# EAGLE design stm32hw06 (EAGLE 9.6.2)
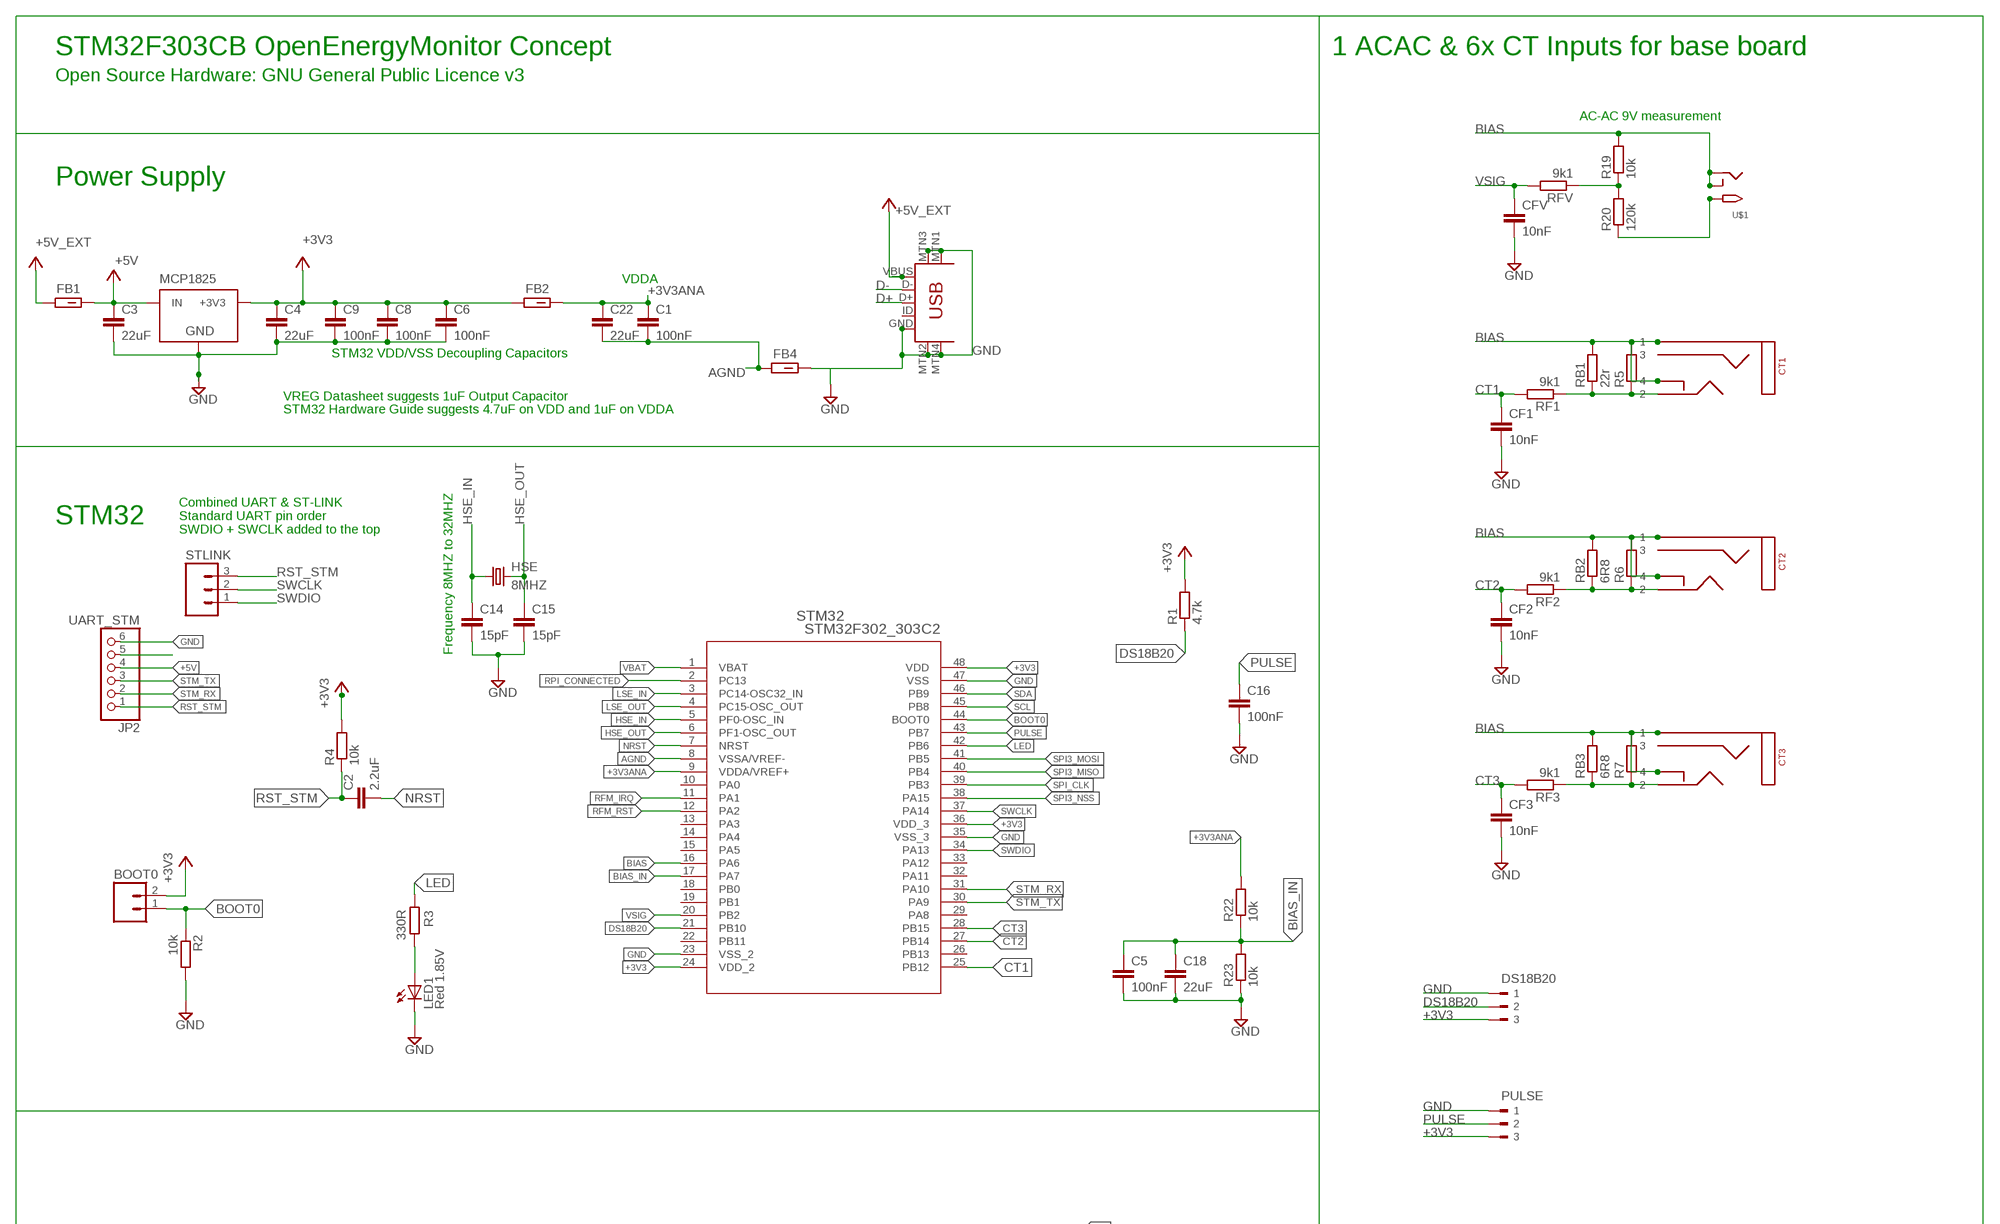
[diagram p0: schematic, sheet 1, part 1 of 2]
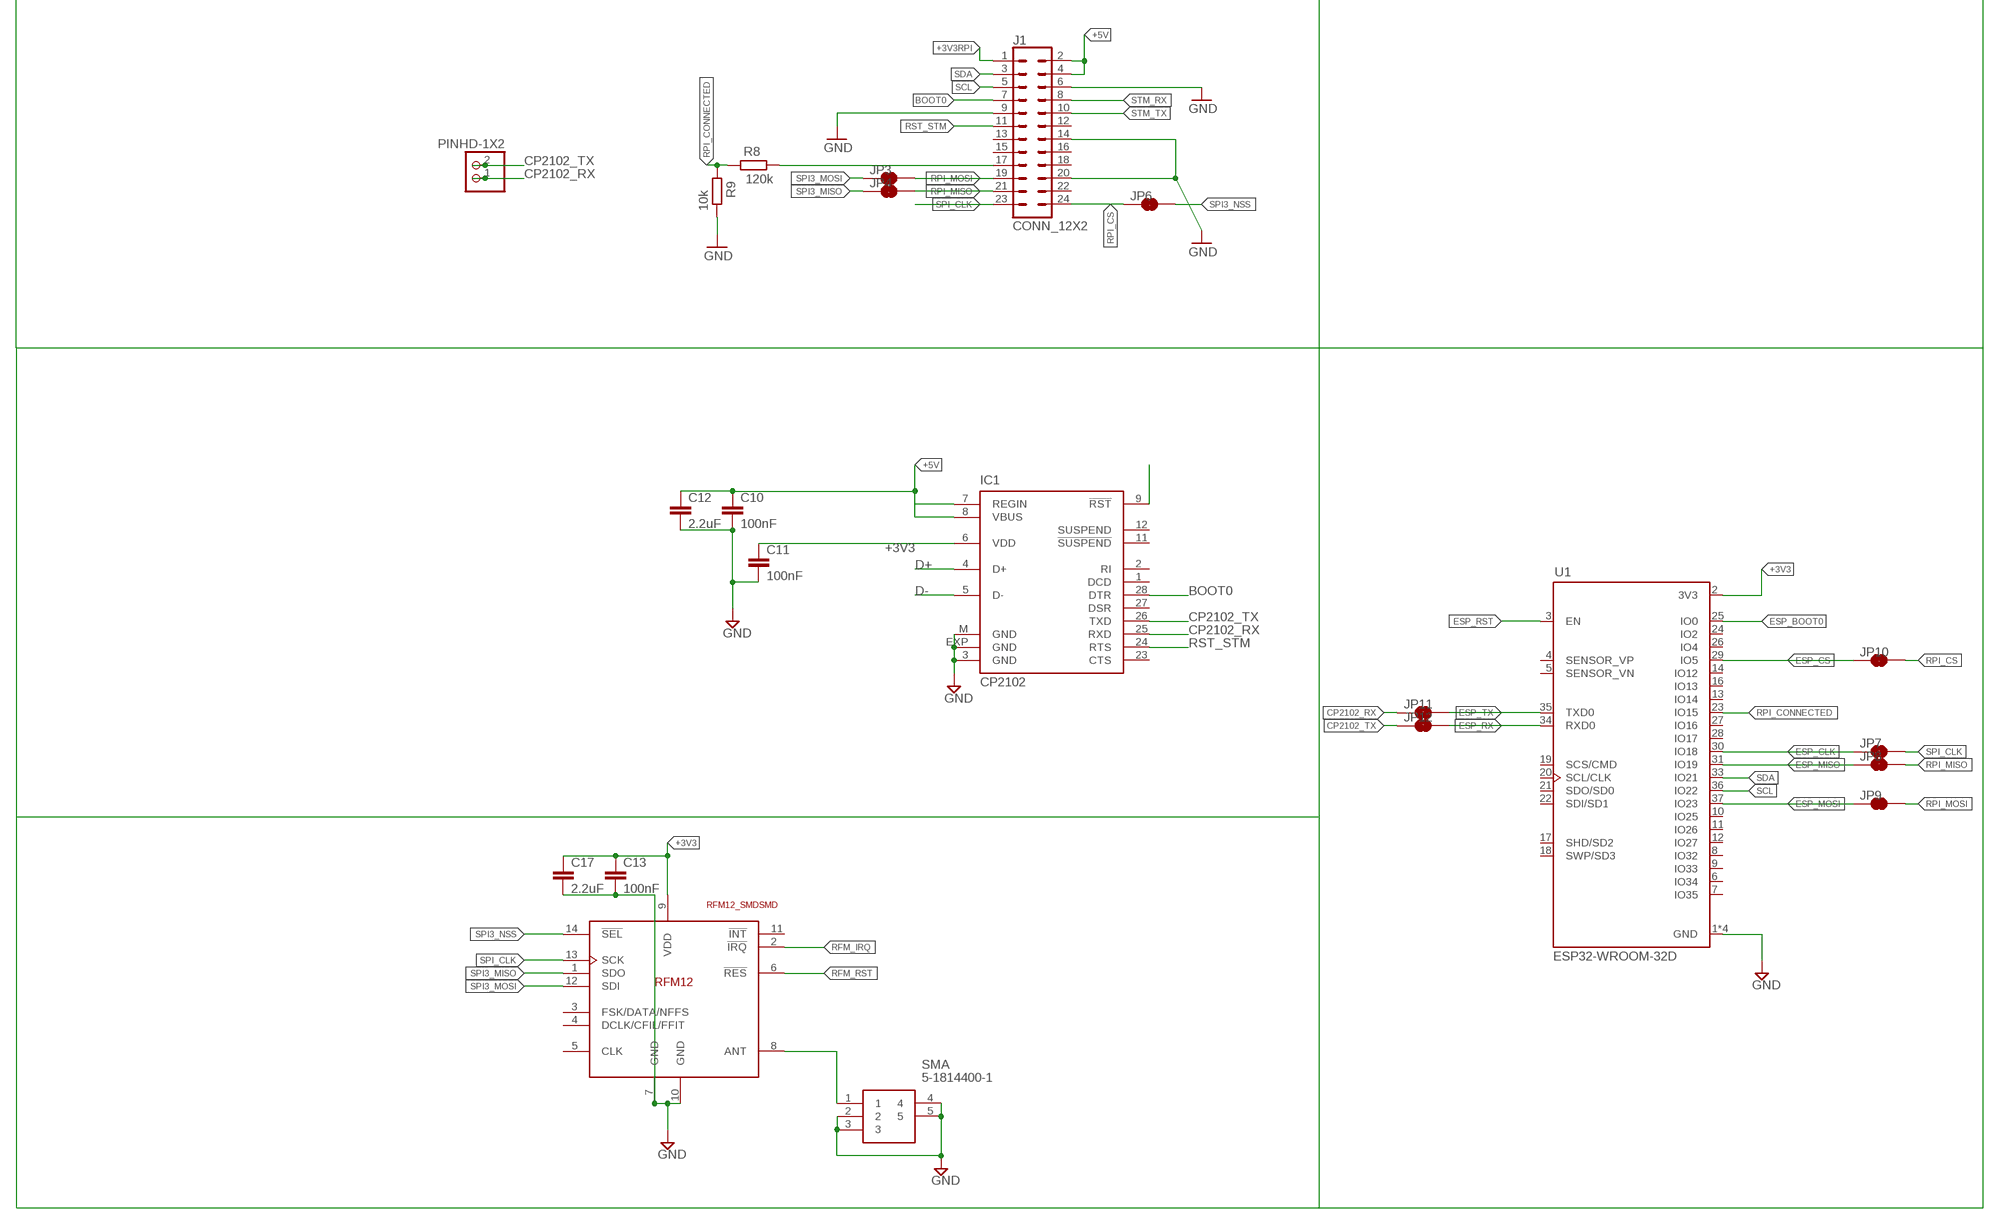
[diagram p1: schematic, sheet 1, part 2 of 2]

## Parts
BOOT0  M02PTH  [1X02]
C1  100nF  C-EUC0603  [C0603]
C2  2.2uF  C-EUC0603  [C0603]
C3  22uF  C-EUC0805  [C0805]
C4  22uF  C-EUC0805  [C0805]
C5  100nF  C-EUC0603  [C0603]
C6  100nF  C-EUC0603  [C0603]
C8  100nF  C-EUC0603  [C0603]
C9  100nF  C-EUC0603  [C0603]
C10  100nF  C-EUC0603  [C0603]
C11  100nF  C-EUC0603  [C0603]
C12  2.2uF  C-EUC0603  [C0603]
C13  100nF  C-EUC0603  [C0603]
C14  15pF  C-EUC0603  [C0603]
C15  15pF  C-EUC0603  [C0603]
C16  100nF  C-EUC0603  [C0603]
C17  2.2uF  C-EUC0603  [C0603]
C18  22uF  C-EUC0805  [C0805]
C22  22uF  C-EUC0805  [C0805]
CF1  10nF  C-EUC0805  [C0805]
CF2  10nF  C-EUC0805  [C0805]
CF3  10nF  C-EUC0805  [C0805]
CFV  10nF  C-EUC0805  [C0805]
CT1  STEREO_SMD  [STEREO_SMT]
CT2  STEREO_SMD  [STEREO_SMT]
CT3  STEREO_SMD  [STEREO_SMT]
DS18B20  180-3  [180-3]
FB1  FBCHIP-0603(1608-METRIC)  [BEADC1608X95N]
FB2  FBCHIP-0603(1608-METRIC)  [BEADC1608X95N]
FB4  FBCHIP-0603(1608-METRIC)  [BEADC1608X95N]
HSE  8MHZ  CRYSTALCTS406  [CTS406]
IC1  CP2102  [MLP28]
J1  CONN_12X2  [2X12]
JP1  PINHD-1X2  [1X02]
JP2  UART_STM  PINHD-1X6  [1X06]
JP3  JUMPER-SMT_2_NC_TRACE_NO-SILK  [SMT-JUMPER_2_NC_TRACE_NO-SILK]
JP4  JUMPER-SMT_2_NC_TRACE_NO-SILK  [SMT-JUMPER_2_NC_TRACE_NO-SILK]
JP6  JUMPER-SMT_2_NC_TRACE_NO-SILK  [SMT-JUMPER_2_NC_TRACE_NO-SILK]
JP7  JUMPER-SMT_2_NC_TRACE_NO-SILK  [SMT-JUMPER_2_NC_TRACE_NO-SILK]
JP8  JUMPER-SMT_2_NC_TRACE_NO-SILK  [SMT-JUMPER_2_NC_TRACE_NO-SILK]
JP9  JUMPER-SMT_2_NC_TRACE_NO-SILK  [SMT-JUMPER_2_NC_TRACE_NO-SILK]
JP10  JUMPER-SMT_2_NC_TRACE_NO-SILK  [SMT-JUMPER_2_NC_TRACE_NO-SILK]
JP11  JUMPER-SMT_2_NC_TRACE_NO-SILK  [SMT-JUMPER_2_NC_TRACE_NO-SILK]
JP12  JUMPER-SMT_2_NC_TRACE_NO-SILK  [SMT-JUMPER_2_NC_TRACE_NO-SILK]
LED1  Red 1.85V  LEDCHIP-LED0805  [CHIP-LED0805]
MCP1825  MCP1825SOT-223-3  [SOT-223]
PULSE  180-3  [180-3]
R1  4.7k  R-EU_R0603  [R0603]
R2  10k  R-EU_R0603  [R0603]
R3  330R  R-EU_R0603  [R0603]
R4  10k  R-EU_R0603  [R0603]
R5  R-EU_0207/10  [0207/10]
R6  R-EU_0207/10  [0207/10]
R7  R-EU_0207/10  [0207/10]
R8  120k  R-EU_R0603  [R0603]
R9  10k  R-EU_R0603  [R0603]
R19  10k  R-EU_R0603  [R0603]
R20  120k  R-EU_R0603  [R0603]
R22  10k  R-EU_R0603  [R0603]
R23  10k  R-EU_R0603  [R0603]
RB1  22r  R-EU_R0603  [R0603]
RB2  6R8  R-EU_R0603  [R0603]
RB3  6R8  R-EU_R0603  [R0603]
RF1  9k1  R-EU_R0603  [R0603]
RF2  9k1  R-EU_R0603  [R0603]
RF3  9k1  R-EU_R0603  [R0603]
RFV  9k1  R-EU_R0603  [R0603]
SMA  5-1814400-1  [518144001]
STLINK  M03PTH  [1X03]
STM32  STM32F302_303C2  [LQFP48-7X7MM]
U1  ESP32-WROOM-32D  [MODULE_ESP32-WROOM-32D]
U$1  2.1MMJACKSMT  [DCJACK_2MM_SMT]
U$2  RFM12_SMDSMD  [RFM12]
U$10  USB-MINIB-5PIN  [USB-MINIB-CISECO]

## Nets
+3V3: BOOT0.2 C4.1 C6.1 C8.1 C9.1 C11.1 C13.1 C17.1 DS18B20.3 FB2.1 IC1.6(VDD) MCP1825.3(+3V3) PULSE.3 R1.2 R4.2 STM32.24(VDD_2) STM32.36(VDD_3) STM32.48(VDD) U1.2(3V3) U$2.9(VDD)
+3V3ANA: C1.1 C22.1 FB2.2 R22.2 STM32.9(VDDA/VREF+)
+3V3RPI: J1.1
+5V: C3.1 C10.1 C12.1 FB1.2 IC1.7(REGIN) IC1.8(VBUS) J1.2 J1.4 JP2.4 MCP1825.1(IN)
+5V_EXT: FB1.1 U$10.VBUS ; supply symbol labelled +5V
AC: R20.1 U$1.PWR2(TIP)
ADC0: R19.1 R20.2 RFV.1
AGND: C1.2 C22.2 FB4.1 STM32.8(VSSA/VREF-)
BIAS: CT1.P$1 CT1.P$4 CT2.P$1 CT2.P$4 CT3.P$1 CT3.P$4 R5.2 R6.2 R7.2 R19.2 RB1.2 RB2.2 RB3.2 STM32.16(PA6) U$1.GND(RING) U$1.GNDBREAK(RING_SW)
BIAS_IN: C5.1 C18.1 R22.1 R23.2 STM32.17(PA7)
BOOT0: BOOT0.1 IC1.28(DTR) J1.7 R2.1 STM32.44(BOOT0)
CP2102_RX: IC1.25(RXD) JP1.1 JP11.1
CP2102_TX: IC1.26(TXD) JP1.2 JP12.1
CT1: CF1.1 RF1.2 STM32.25(PB12)
CT2: CF2.1 RF2.2 STM32.27(PB14)
CT3: CF3.1 RF3.2 STM32.28(PB15)
D+: IC1.4(D+) U$10.D+
D-: IC1.5(D-) U$10.D-
DS18B20: DS18B20.2 R1.1 STM32.21(PB10)
ESP_BOOT0: U1.25(IO0)
ESP_CLK: JP7.1 U1.30(IO18)
ESP_CS: JP10.1 U1.29(IO5)
ESP_MISO: JP8.1 U1.31(IO19)
ESP_MOSI: JP9.1 U1.37(IO23)
ESP_RST: U1.3(EN)
ESP_RX: JP12.2 U1.34(RXD0)
ESP_TX: JP11.2 U1.35(TXD0)
GND: C3.2 C4.2 C5.2 C6.2 C8.2 C9.2 C10.2 C11.2 C12.2 C13.2 C14.2 C15.2 C16.2 C17.2 C18.2 CF1.2 CF2.2 CF3.2 CFV.2 DS18B20.1 FB4.2 IC1.3(GND) IC1.EXP(GND) IC1.M(GND) J1.6 J1.14 J1.20 JP2.6 LED1.C MCP1825.2(GND) PULSE.1 R2.2 R9.1 R23.1 SMA.2 SMA.3 SMA.4 SMA.5 STM32.23(VSS_2) STM32.35(VSS_3) STM32.47(VSS) U1.1(GND) U1.15(GND) U1.38(GND) U1.39(GND) U$2.7(GND) U$2.10(GND) U$10.GND U$10.MTN1(MTN2) U$10.MTN2(MTN3) U$10.MTN3(MTN1) U$10.MTN4
HSE_IN: C14.1 HSE.1 STM32.5(PF0-OSC_IN)
HSE_OUT: C15.1 HSE.3 STM32.6(PF1-OSC_OUT)
LED: R3.2 STM32.42(PB6)
LSE_IN: STM32.3(PC14-OSC32_IN)
LSE_OUT: STM32.4(PC15-OSC_OUT)
N$1: IC1.9(!RST)
N$2: CT1.P$2 R5.1 RB1.1 RF1.1
N$5: J1.9 ; supply symbol labelled GND
N$8: CT2.P$2 R6.1 RB2.1 RF2.1
N$10: CT3.P$2 R7.1 RB3.1 RF3.1
N$18: SMA.1 U$2.8(ANT)
N$19: JP2.5
N$41: LED1.A R3.1
NRST: C2.2 STM32.7(NRST)
PULSE: C16.1 PULSE.2 STM32.43(PB7)
RFM_IRQ: STM32.11(PA1) U$2.2(!IRQ)
RFM_RST: STM32.12(PA2) U$2.6(!RES)
RPI_CONNECTED: R8.2 R9.2 STM32.2(PC13) U1.23(IO15)
RPI_CONNECTED_PR: J1.17 R8.1
RPI_CS: J1.24 JP6.1 JP10.2
RPI_MISO: J1.21 JP4.2 JP8.2
RPI_MOSI: J1.19 JP3.2 JP9.2
RST_STM: C2.1 IC1.24(RTS) J1.11 JP2.1 R4.1 STLINK.3
SCL: J1.5 STM32.45(PB8) U1.36(IO22)
SDA: J1.3 STM32.46(PB9) U1.33(IO21)
SPI3_MISO: JP4.1 STM32.40(PB4) U$2.1(SDO)
SPI3_MOSI: JP3.1 STM32.41(PB5) U$2.12(SDI)
SPI3_NSS: JP6.2 STM32.38(PA15) U$2.14(!SEL)
SPI_CLK: J1.23 JP7.2 STM32.39(PB3) U$2.13(SCK)
STM_RX: J1.8 JP2.2 STM32.31(PA10)
STM_TX: J1.10 JP2.3 STM32.30(PA9)
SWCLK: STLINK.2 STM32.37(PA14)
SWDIO: STLINK.1 STM32.34(PA13)
VBAT: STM32.1(VBAT)
VSIG: CFV.1 RFV.2 STM32.20(PB2)
Unconnected: CT1.P$3 CT2.P$3 CT3.P$3 IC1.1(DCD) IC1.2(RI) IC1.11(!SUSPEND) IC1.12(SUSPEND) IC1.23(CTS) IC1.27(DSR) J1.12 J1.13 J1.15 J1.16 J1.18 J1.22 STM32.10(PA0) STM32.13(PA3) STM32.14(PA4) STM32.15(PA5) STM32.18(PB0) STM32.19(PB1) STM32.22(PB11) STM32.26(PB13) STM32.29(PA8) STM32.32(PA11) STM32.33(PA12) U1.4(SENSOR_VP) U1.5(SENSOR_VN) U1.6(IO34) U1.7(IO35) U1.8(IO32) U1.9(IO33) U1.10(IO25) U1.11(IO26) U1.12(IO27) U1.13(IO14) U1.14(IO12) U1.16(IO13) U1.17(SHD/SD2) U1.18(SWP/SD3) U1.19(SCS/CMD) U1.20(SCL/CLK) U1.21(SDO/SD0) U1.22(SDI/SD1) U1.24(IO2) U1.26(IO4) U1.27(IO16) U1.28(IO17) U$2.3(FSK/DATA/NFFS) U$2.4(DCLK/CFIL/FFIT) U$2.5(CLK) U$2.11(!INT) U$10.ID

## Notes on the sheet
- STM32F303CB OpenEnergyMonitor Concept | 1 ACAC & 6x CT Inputs for base board
- Open Source Hardware: GNU General Public Licence v3
- AC-AC 9V measurement
- Power Supply
- VDDA
- STM32 VDD/VSS Decoupling Capacitors
- VREG Datasheet suggests 1uF Output Capacitor
- STM32 Hardware Guide suggests 4.7uF on VDD and 1uF on VDDA
- STM32
- Combined UART & ST-LINK
  Standard UART pin order
  SWDIO + SWCLK added to the top
- Frequency 8MHZ to 32MHZ

## Library data of the parts
BOOT0 = SparkFun:M02: Header 2 Standard 2-pin 0.1" header. Use with straight break away headers (SKU : PRT-00116), right angle break away headers (PRT-00553), swiss pins (PRT-00743), machine pins (PRT-00117), and female headers (PRT-00115). Molex polarized connector foot print use with SKU : PRT-08233 with associated crimp pins and housings.
C1 C2 C5 C6 C8 C9 C14-C16 = resistor:C-EU: CAPACITOR, European symbol
C3 C4 C10-C13 C17 C18 C22 CF1-CF3 CFV = rcl:C-EU: CAPACITOR, European symbol; SPICEPREFIX: C
CT1-CT3 = IotaWatt_parts:STEREO_SMD: 3.5mm Stereo Jack SMT
DS18B20 PULSE = con-weidmueller-sl35:180-3: WEIDMUELLER CLAMP CONNECTOR; OC_FARNELL: unknown; OC_NEWARK: unknown
FB1 FB2 FB4 = Filter:FB: Ferrite Bead - Generic; CATEGORY: Filter; SUB-CATEGORY: Ferrite bead
HSE = crystal:CRYSTAL: CRYSTAL; OC_FARNELL: unknown; OC_NEWARK: unknown
IC1 = silabs:CP210*: Single-Chip USB to UART Bridge Source: www.silabs.com .. CP2101.pdf / cp2102.pdf; MF: FARNELL; MPN: CP2102-GM; OC_FARNELL: 9282130; OC_NEWARK: 30K5635
J1 = SparkFun-Connectors:CONN_12X2: Multi connection point. Often used as Generic Header-pin footprint for 0.1 inch spaced/style header connections On any of the 0.1 inch spaced packages, you can populate with these: Break Away Headers - Straight <https://www.sparkfun.com/products/116> (PRT-00116) Break Away Male Headers - Right Angle <https://www.sparkfun.com/products/553> (PRT-00553) Female Headers <https://www.sparkfun.com/products/115> (PRT-00115) Break Away Headers - Machine Pin <https://www.sparkfun.com/products/117> (PRT-00117) Break Away Female Headers - Swiss Machine Pin <https://www.sparkfun.com/products/743> (PRT-00743)
JP1 = Connector:PINHD-1X2: PIN HEADER; CATEGORY: CONNECTOR; SUB-CATEGORY: PIN-HEADER
JP2 = Connector:PINHD-1X6: PIN HEADER; CATEGORY: CONNECTOR; SUB-CATEGORY: PIN-HEADER
JP3 JP4 JP6-JP12 = SparkFun-Jumpers:JUMPER-SMT_2_NC_TRACE: Normally closed trace jumper This jumper has a trace between two pads so it's normally closed (NC). Use a razor knife to open the connection. For best results follow the IPC guidelines for cutting traces: Cutout at least 0.063 mm (0.005 in). Remove all loose material to clean up the cut area. Seal the cut with an approved epoxy. Reapply solder to reclose the connection.
LED1 = adafruit:LED: LED OSRAM: - CHIPLED LG R971, LG N971, LY N971, LG Q971, LY Q971, LO R971, LY R971 LH N974, LH R974 LS Q976, LO Q976, LY Q976 LO Q996 - Hyper CHIPLED LW Q18S LB Q993, LB Q99A, LB R99A - SideLED LS A670, LO A670, LY A670, LG A670, LP A670 LB A673, LV A673, LT A673, LW A673 LH A674 LY A675 LS A676, LA A676, LO A676, LY A676, LW A676 LS A679, LY A679, LG A679 - Hyper Micro SIDELED® LS Y876, LA Y876, LO Y876, LY Y876 LT Y87S - SmartLED LW L88C, LW L88S LB L89C, LB L89S, LG L890 LS L89K, LO L89K, LY L89K LS L896, LA L896, LO L896, LY L896 - TOPLED LS T670, LO T670, LY T670, LG T670, LP T670 LSG T670, LSP T670, LSY T670, LOP T670, LYG T670 LG T671, LOG T671, LSG T671 LB T673, LV T673, LT T673, LW T673 LH T674 LS T676, LA T676, LO T676, LY T676, LB T676, LH T676, LSB T676, LW T676 LB T67C, LV T67C, LT T67C, LS T67K, LO T67K, LY T67K, LW E67C LS E67B, LA E67B, LO E67B, LY E67B, LB E67C, LV E67C, LT E67C LW T67C LS T679, LY T679, LG T679 LS T770, LO T770, LY T770, LG T770, LP T770 LB T773, LV T773, LT T773, LW T773 LH T774 LS E675, LA E675, LY E675, LS T675 LS T776, LA T776, LO T776, LY T776, LB T776 LHGB T686 LT T68C, LB T68C - Hyper Mini TOPLED® LB M676 - Mini TOPLED Santana® LG M470 LS M47K, LO M47K, LY M47K Source: http://www.osram.convergy.de/
MCP1825 = SteelCaveRobotics-Power:MCP1825: MCP1825 3.3v LDO Linear Regulator
R1 R2 R4 R19 R20 R22 R23 RB1-RB3 RF1-RF3 RFV = resistor:R-EU_: RESISTOR, European symbol
R3 R8 R9 = rcl:R-EU_: RESISTOR, European symbol
R5-R7 = rcl:R-EU_: RESISTOR, European symbol; SPICEPREFIX: R
SMA = 5-1814400-1 sma connector:5-1814400-1: SMA Connector Jack, Female Socket 50 Ohm Through Hole, Right Angle Solder Source: Datasheet <http://uk.rs-online.com/web/p/products/6163400>; ALLIED_NUMBER: 70084631; DESCRIPTION: SMA Connector Jack, Female Socket 50 Ohm Through Hole, Right Angle Solder; HEIGHT: 10.43mm; MANUFACTURER_NAME: TE Connectivity; MANUFACTURER_PART_NUMBER: 5-1814400-1; RS_PART_NUMBER: 6163400; RS_PRICE-STOCK: http://uk.rs-online.com/web/p/products/6163400
STLINK = SparkFun:M03: Header 3 Standard 3-pin 0.1" header. Use with straight break away headers (SKU : PRT-00116), right angle break away headers (PRT-00553), swiss pins (PRT-00743), machine pins (PRT-00117), and female headers (PRT-00115). Molex polarized connector foot print use with SKU : PRT-08232 with associated crimp pins and housings.
STM32 = stm32f303cb:STM32F302_303C2; MANUFACTURER_PART_NUMBER: stm32f302_303c2; VENDOR: STMicroelectronics
U1 = ESP32-WROOM-32D:ESP32-WROOM-32D: IC: SoC; GPIO, I2C, I2S, IR, SD, SDIO, SPI, UART; 2.7÷3.6VDC; 20dBm; AVAILABILITY: Unavailable; DESCRIPTION: IC: SoC; GPIO, I2C, I2S, IR, SD, SDIO, SPI, UART; 2.7÷3.6VDC; 20dBm; MF: Espressif Systems; MP: ESP32-WROOM-32D; PACKAGE: Module Espressif Systems; PRICE: None
U$1 = adafruit:2.1MMJACK: 2.1mm x 5.5mm THM DC jack with internal switch. Digikey part #PJ-102A, 4UCON part #05537 2.1mm x 5.5mm SMT DC jack with internal switch. Digikey part #PJ-002A-SMT, 4UCON part #03267 By microbuilder.eu & adafruit.com
U$2 = rfm12b _ rfm69cw:RFM12_SMD: RFM12 is a low costing ISM band transceiver module implemented with unique PLL. It works signal ranges from 315/433/868/915MHZ bands, comply with FCC, ETSI regulation. The SPI interface is used to communicate with microcontroller for parameter setting.
U$10 = Ciseco USB miniB_Updated:USB-MINIB: Mini-USB "B" connector with 5th pin broken out. Created new symbol breaking out 5th "ID" pin in mini/micro USB connector spec. See: http://en.wikipedia.org/wiki/Mini_usb#Cables. Uses same footprint as 4-pin symbol. Also added pins to connect to mounting / shield pads if required (probably not generally needed as signals aren't shielded once they leave the connector). Modified by Ciseco for Rapid Part 24-0357

## Net classes
0 default: width 0.203 mm, drill 0.5 mm, clearance 0.152 mm
1 power: width 0.381 mm, drill 0.5 mm, clearance 0.254 mm
2 gnd: width 0.254 mm, drill 0.5 mm, clearance 0.254 mm

## Board
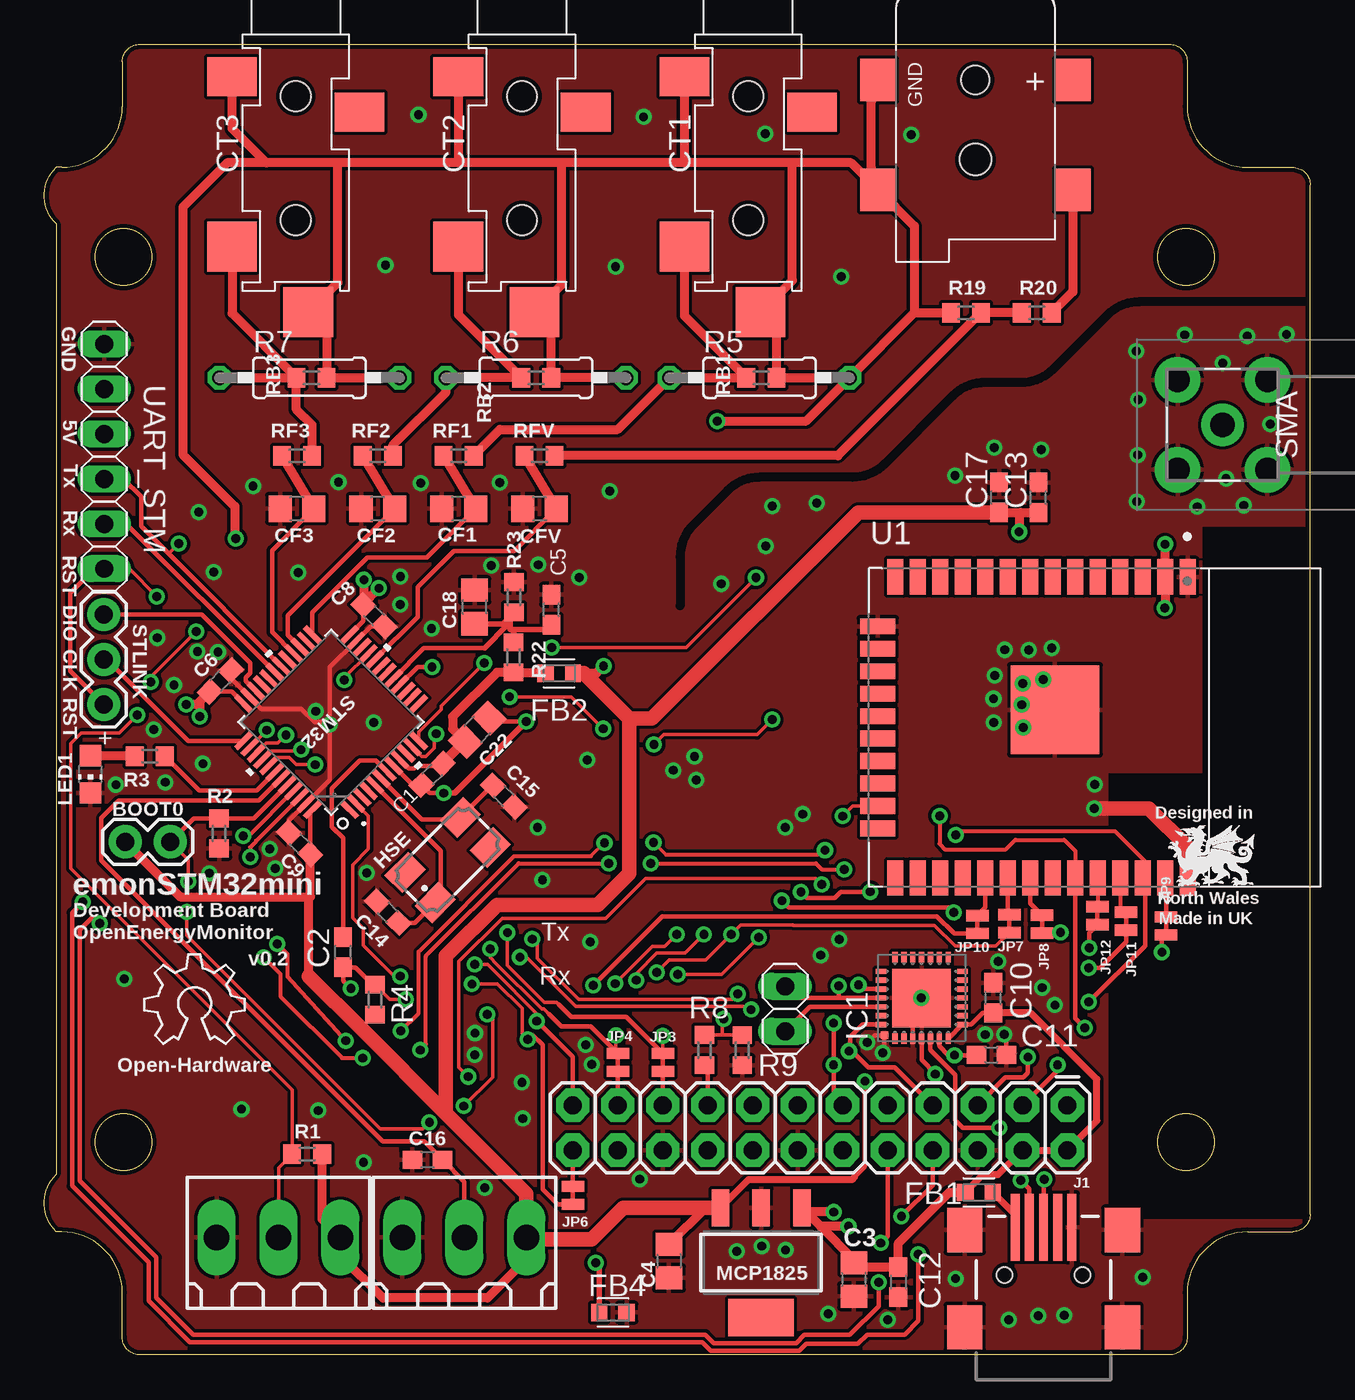
[diagram p2: board, top side]
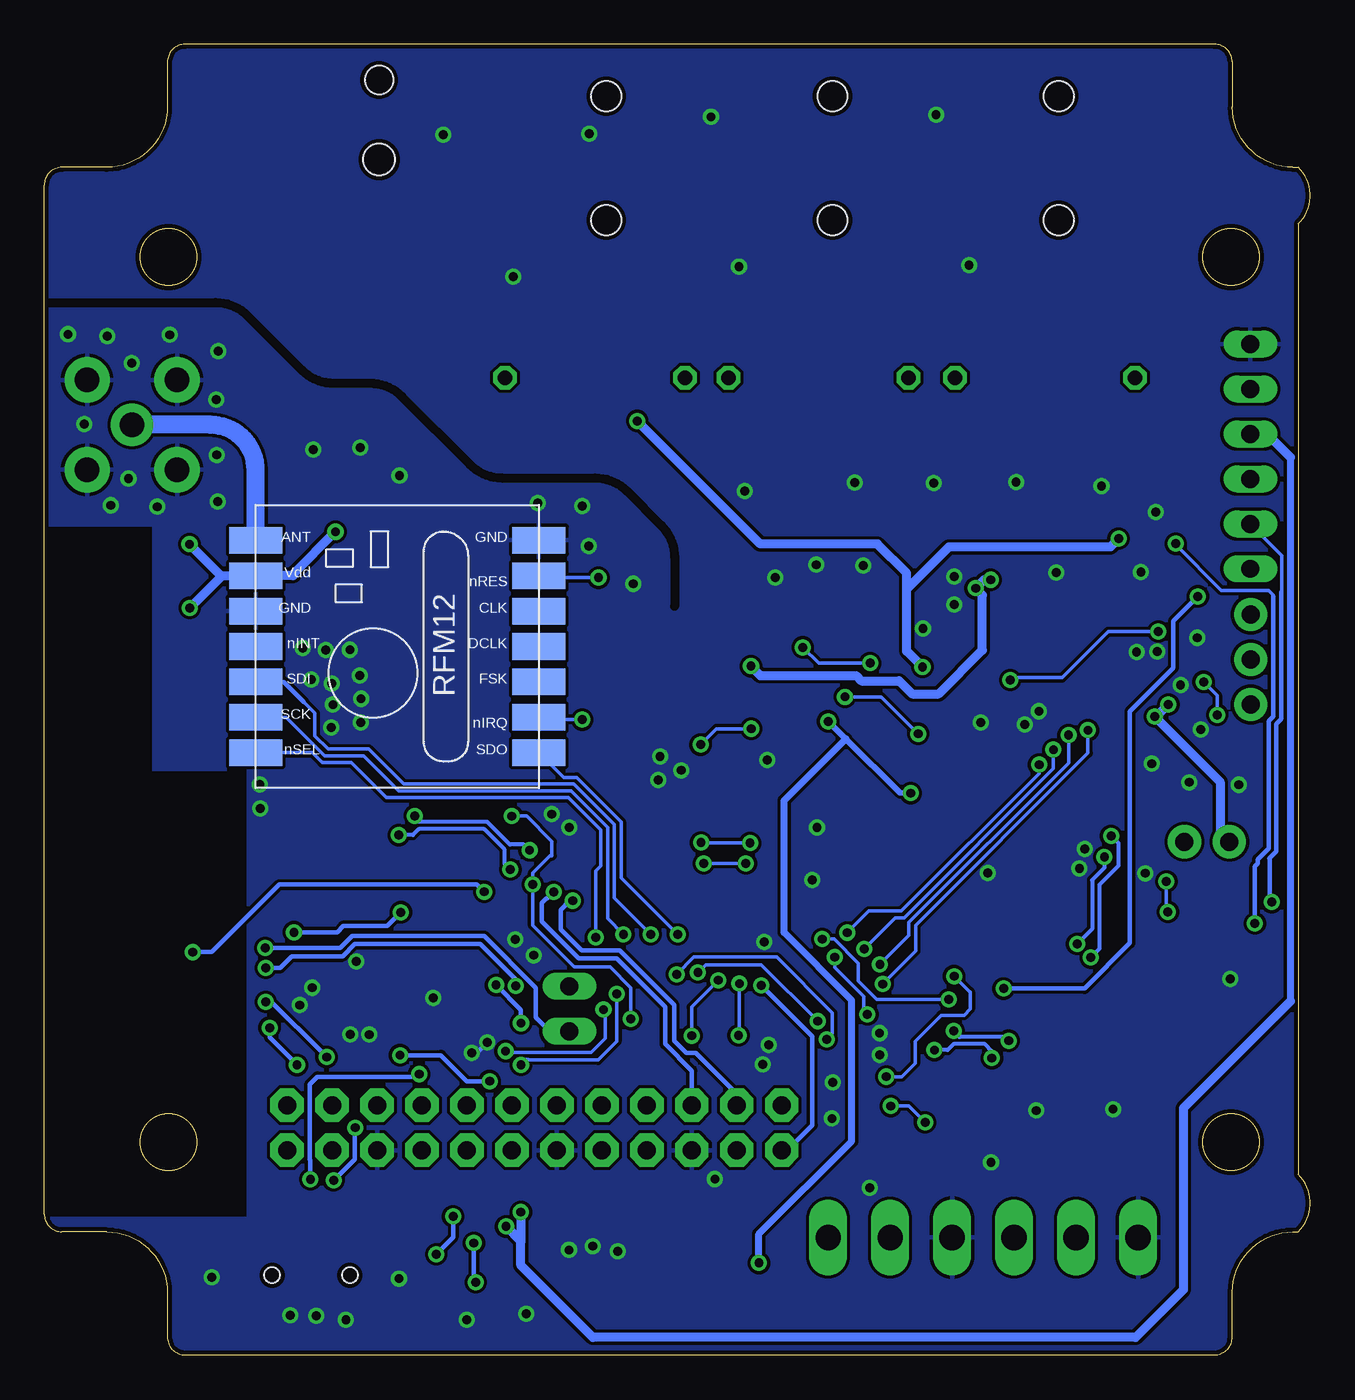
[diagram p3: board, bottom side, seen from below]

Size 71.5 x 74.04 mm. Coordinates in mm from the lower left corner, seen from the top.
Outline: 64.55,3.52 64.55,1 arc-90 63.55,0 5.41,0 arc-90 4.41,1 4.41,3.52 arc90 0.98,6.95 0.67,6.95 arc-90 0.67,10.2 0.67,63.89 arc-90 0.67,67.09 0.98,67.09 arc90 4.41,70.52 4.41,73.04 arc-90 5.41,74.04 63.55,74.04 arc-90 64.55,73.04 64.55,70.52 arc90 67.98,67.09 70.5,67.09 arc-90 71.5,66.09 71.5,7.95 arc-90 70.5,6.95 67.98,6.95 arc90 64.55,3.52
Outline: circle at 4.48,12.02 radius 1.61
Outline: circle at 4.48,62.02 radius 1.61
Outline: circle at 64.48,62.02 radius 1.61
Outline: circle at 64.48,12.02 radius 1.61
Copper layers (1*16): Top 0.035mm / dielectric 1.5mm / Bottom 0.035mm
Design rules "stmMini *": minimum track width 8mil, minimum drill 0.5mm, track to track 7mil, track to pad 7mil, pad to pad 7mil, via to via 7mil, smd to smd 6mil, copper to edge 10mil, drill to drill 8mil, minimum pad ring 10mil, minimum via ring 8mil, stop-mask expansion 4mil, vias tented up to drill 0.6mm, thermal gap 8mil
tRestrict: area 60.1,7.7 to 77.7,32.8; area 65.4,24.4 to 74.5,46.8; 13 lines
bRestrict: area 60.1,7.8 to 77.7,33; area 65.4,24.4 to 74.5,46.8; 13 lines

### Footprints (pad centres in the part's own frame; a part is rotated, then mirrored left to right if it is on the bottom)
1X02 = drill 1.016 pad 1.88: 1 0,0; 2 2.54,0
C0603 = smd 1.1 x 1: 1 -0.85,0; 2 0.85,0
C0805 = smd 1.3 x 1.5: 1 -0.95,0; 2 0.95,0
STEREO_SMT = smd 2.8 x 2.2: P$1 -3.6,-2.4; P$3 3.6,-4.4 | smd 2.8 x 2.8: P$2 -3.6,-12; P$4 0.7,-15.7 | hole 1.7: 0,-3.5; 0,-10.5
180-3 = drill 1.422 long: 1 -3.5,0; 2 0,0; 3 3.5,0
BEADC1608X95N = smd 0.9 x 0.97: 1 -0.785,0 | smd 0.933 x 0.97: 2 0.769,0
CTS406 = smd 1.9 x 1.4: 1 -2.2,-1.2; 2 2.2,-1.2; 3 2.2,1.2; 4 -2.2,1.2
MLP28 = smd 0.6 x 0.3: 1 -2.3,1.5; 2 -2.3,1; 3 -2.3,0.5; 4 -2.3,0; 5 -2.3,-0.5; 6 -2.3,-1; 7 -2.3,-1.5; 15 2.3,-1.5; 16 2.3,-1; 17 2.3,-0.5; 18 2.3,0; 19 2.3,0.5; 20 2.3,1; 21 2.3,1.5 | smd 0.3 x 0.6: 8 -1.5,-2.3; 9 -1,-2.3; 10 -0.5,-2.3; 11 0,-2.3; 12 0.5,-2.3; 13 1,-2.3; 14 1.5,-2.3; 22 1.5,2.3; 23 1,2.3; 24 0.5,2.3; 25 0,2.3; 26 -0.5,2.3; 27 -1,2.3; 28 -1.5,2.3 | smd 3.3 x 3.3: EXP 0,0 | smd 0.435 x 0.435: M -2.103,2.103
2X12 = drill 1.016 pad 1.88 octagon: 1 0,0; 2 0,2.54; 3 2.54,0; 4 2.54,2.54; 5 5.08,0; 6 5.08,2.54; 7 7.62,0; 8 7.62,2.54; 9 10.16,0; 10 10.16,2.54; 11 12.7,0; 12 12.7,2.54; 13 15.24,0; 14 15.24,2.54; 15 17.78,0; 16 17.78,2.54; 17 20.32,0; 18 20.32,2.54; 19 22.86,0; 20 22.86,2.54; 21 25.4,0; 22 25.4,2.54; 23 27.94,0; 24 27.94,2.54
1X02' = drill 1.016 long: 1 -1.27,0; 2 1.27,0
1X06 = drill 1.016 long: 1 -6.35,0; 2 -3.81,0; 3 -1.27,0; 4 1.27,0; 5 3.81,0; 6 6.35,0
SMT-JUMPER_2_NC_TRACE_NO-SILK = smd 0.635 x 1.27: 1 -0.508,0; 2 0.508,0
CHIP-LED0805 = smd 1.2 x 1.2: A 0,-1.05; C 0,1.05
SOT-223 = smd 1 x 2.1: 1 -2.3,-3.1; 2 0,-3.1; 3 2.3,-3.1 | smd 3.7 x 2.1: 4 0,3.1
R0603 = smd 1 x 1.1: 1 -0.85,0; 2 0.85,0
0207/10 = drill 0.813 octagon: 1 -5.08,0; 2 5.08,0
518144001 = drill 1.4 pad 2.4: 1 0,0 | drill 1.4 pad 2.55: 2 -2.54,2.54; 3 -2.54,-2.54; 4 2.54,-2.54; 5 2.54,2.54
1X03 = drill 1.016 pad 1.88: 1 0,0; 2 2.54,0; 3 5.08,0
LQFP48-7X7MM = smd 1.194 x 0.305: 1 -4.25,2.75; 2 -4.25,2.25; 3 -4.25,1.75; 4 -4.25,1.25; 5 -4.25,0.75; 6 -4.25,0.25; 7 -4.25,-0.25; 8 -4.25,-0.75; 9 -4.25,-1.25; 10 -4.25,-1.75; 11 -4.25,-2.25; 12 -4.25,-2.75; 25 4.25,-2.75; 26 4.25,-2.25; 27 4.25,-1.75; 28 4.25,-1.25; 29 4.25,-0.75; 30 4.25,-0.25; 31 4.25,0.25; 32 4.25,0.75; 33 4.25,1.25; 34 4.25,1.75; 35 4.25,2.25; 36 4.25,2.75 | smd 0.305 x 1.194: 13 -2.75,-4.25; 14 -2.25,-4.25; 15 -1.75,-4.25; 16 -1.25,-4.25; 17 -0.75,-4.25; 18 -0.25,-4.25; 19 0.25,-4.25; 20 0.75,-4.25; 21 1.25,-4.25; 22 1.75,-4.25; 23 2.25,-4.25; 24 2.75,-4.25; 37 2.75,4.25; 38 2.25,4.25; 39 1.75,4.25; 40 1.25,4.25; 41 0.75,4.25; 42 0.25,4.25; 43 -0.25,4.25; 44 -0.75,4.25; 45 -1.25,4.25; 46 -1.75,4.25; 47 -2.25,4.25; 48 -2.75,4.25
MODULE_ESP32-WROOM-32D = smd 2 x 0.9: 1 -8.5,5.26; 2 -8.5,3.99; 3 -8.5,2.72; 4 -8.5,1.45; 5 -8.5,0.18; 6 -8.5,-1.09; 7 -8.5,-2.36; 8 -8.5,-3.63; 9 -8.5,-4.9; 10 -8.5,-6.17; 11 -8.5,-7.44; 12 -8.5,-8.71; 13 -8.5,-9.98; 14 -8.5,-11.25; 25 8.5,-11.25; 26 8.5,-9.98; 27 8.5,-8.71; 28 8.5,-7.44; 29 8.5,-6.17; 30 8.5,-4.9; 31 8.5,-3.63; 32 8.5,-2.36; 33 8.5,-1.09; 34 8.5,0.18; 35 8.5,1.45; 36 8.5,2.72; 37 8.5,3.99; 38 8.5,5.26 | smd 0.9 x 2: 15 -5.715,-12.25; 16 -4.445,-12.25; 17 -3.175,-12.25; 18 -1.905,-12.25; 19 -0.635,-12.25; 20 0.635,-12.25; 21 1.905,-12.25; 22 3.175,-12.25; 23 4.445,-12.25; 24 5.715,-12.25 | smd 5 x 5: 39 -1,-2.24
DCJACK_2MM_SMT = smd 2.4 x 2: GND 0,-5.5; GNDBREAK 6.2,-5.5; PWR1 0,5.5; PWR2 6.2,5.5 | hole 1.6: 0,0 | hole 1.8: 4.5,0
RFM12 = smd 1.5 x 3: 1 -5,-10; 2 -3,-10; 3 -1,-10; 4 1,-10; 5 3,-10; 6 5,-10; 7 7,-10; 8 7,6; 9 5,6; 10 3,6; 11 1,6; 12 -1,6; 13 -3,6; 14 -5,6
USB-MINIB-CISECO = smd 3.8 x 0.5: D+ 7.9,0; D- 7.9,0.8; GND 7.9,-1.6; ID 7.9,-0.8; VBUS 7.9,1.6 | smd 2.5 x 2: MTN1 2.25,4.45; MTN2 7.75,4.45; MTN3 2.25,-4.45; MTN4 7.75,-4.45 | hole 0.9: 5.2,2.2; 5.2,-2.2

### Placement (x,y rotation side)
BOOT0  7.11,28.98 180 top
C1  21.91,32.8 225 top
C2  16.88,22.75 90 top
C3  45.72,4.26 270 top
C4  35.28,5.3 270 top
C5  28.64,42.09 90 top
C6  9.95,38.07 45 top
C8  18.61,41.76 315 top
C9  14.42,28.89 135 top
C10  53.59,20.17 90 top
C11  53.49,16.94 0 top
C12  48.23,4.11 270 top
C13  56.14,48.43 90 top
C14  19.4,25 135 top
C15  25.95,31.57 315 top
C16  21.64,11.02 180 top
C17  53.92,48.44 90 top
C18  24.3,42.25 90 top
C22  24.46,35.32 45 top
CF1  23.4,47.8 180 top
CF2  18.84,47.8 180 top
CF3  14.27,47.8 180 top
CFV  27.97,47.8 180 top
CT1  39.75,74.6 0 top
CT2  26.98,74.6 0 top
CT3  14.21,74.6 0 top
DS18B20  13.23,6.63 0 top
FB1  52.78,9.18 180 top
FB2  29.07,38.51 180 top
FB4  32.12,2.39 0 top
HSE  22.78,27.96 45 top
IC1  49.55,20.16 90 top
J1  57.78,14.1 180 top
JP1  PINHD-1X2  [1X02']  41.84,19.55 270 top
JP2  3.39,50.76 90 top
JP3  34.94,16.52 270 top
JP4  32.4,16.52 270 top
JP6  29.85,9.01 270 top
JP7  54.5,24.35 270 top
JP8  56.35,24.33 270 top
JP9  63.36,24.24 270 top
JP10  52.7,24.31 270 top
JP11  61.09,24.5 90 top
JP12  59.48,24.81 90 top
LED1  2.61,32.79 180 top
LOGO1  OSHW_LOGO_6MILX0200-NT  [OSHW_6X200_NOTEXT]  5.65,17.55 0 top
MCP1825  40.48,5.21 180 top
PULSE  23.73,6.63 0 top
R1  14.85,11.33 0 top
R2  9.88,29.45 270 top
R3  5.96,33.83 0 top
R4  18.68,20.07 270 top
R5  40.39,55.2 0 top
R6  27.77,55.2 0 top
R7  14.97,55.2 0 top
R8  37.29,17.22 90 top
R9  39.42,17.21 90 top
R19  52.05,58.87 180 top
R20  56.05,58.87 180 top
R22  26.5,39.41 270 top
R23  26.52,42.8 270 top
RB1  40.5,55.2 0 top
RB2  27.78,55.2 0 top
RB3  15.09,55.2 0 top
RF1  23.4,50.8 180 top
RF2  18.84,50.8 180 top
RF3  14.27,50.8 180 top
RFV  27.97,50.8 180 top
SMA  66.54,52.54 270 top
STLINK  3.36,41.82 270 top
STM32  16.2,35.74 135 top
U1  59.32,35.44 270 top
U$1  52.59,72.02 270 top
U$2  53.56,39.02 90 bottom
U$10  56.43,-0.7 90 top

### Tracks (layer width: path | path; a pad name or v marks a point on that pad's centre or on a via)
+3V3  (via drill 0.5)
  Top 0.203: R4.2 17.98,18.52 17.98,18.34
  Top 0.254: C8.1 18.01,41.45 STM32.24 | C6.1 10.58,37.47 STM32.36 | STM32.48 15.02,30.68 C9.1 | IC1.6 50.55,17.45 51.06,16.93 v51.4,16.93 52.63,16.93 C11.1 | v46.35,15.46 46.35,10.62 45.77,10.04
  Top 0.406: 45.77,10.04 45.62,9.9 39.77,9.9 MCP1825.3
  Top 0.508: 27.33,6.53 PULSE.3 27.23,5.4 25.04,3.21 19.12,3.21 16.73,5.6 DS18B20.3 15.7,7.66 R1.2 | MCP1825.3 37.34,8.31 C4.1 | 14.93,21.39 14.93,25.88 | C9.1 15.02,25.88 14.93,25.88 | v8.01,36.74 8.62,36.74 C6.1 8.79,36.91 v8.79,36.06 | BOOT0.2 7.67,25.88 14.93,25.88 | v18.9,43.31 18.01,42.42 C8.1 18.05,42.4 v18.05,43.79 | C17.1 55.12,47.59 | 55.12,47.59 C13.1 | 55.12,47.59 55.05,47.52 v55.05,46.5 | FB2.1 31.19,38.51 v31.59,38.91 | v63.3,45.79 63.3,43.96 U1.2 63.31,42.22 v63.28,42.19
  Top 0.813: MCP1825.3 32.71,8.31 30.93,6.53 27.33,6.53 | PULSE.3 27.23,9.09 22.68,13.64 | 22.68,13.64 17.98,18.34 14.93,21.39 | 22.68,13.64 22.68,22.52 25.57,25.41 31.26,25.41 33.03,27.19 33.03,35.94 | 33.03,35.94 30.46,38.51 FB2.1 | 33.03,35.94 34.32,35.94 45.97,47.59 C17.1
  Bottom 0.254: v51.4,16.93 49.1,16.93 47.63,15.46 v46.35,15.46
  Bottom 0.508: v8.01,36.74 8.69,36.06 v8.79,36.06 5.09,32.37 5.09,29.5 BOOT0.2 | v18.05,43.79 18.42,43.79 v18.9,43.31 18.52,42.92 18.52,39.81 20.99,37.33 22.48,37.33 23.22,38.08 25.36,38.08 25.65,38.37 31.05,38.37 v31.59,38.91 | v55.05,46.5 57.4,44.15 57.4,44.05 57.44,44.02 U$2.9 61.46,44.02 | v63.3,45.79 61.52,44.02 61.46,44.02 | v63.28,42.19 61.46,44.02
+3V3ANA
  Top 0.254: C1.1 22.28,33.4 | STM32.9 20.59,33.11 20.89,33.11 21.03,33.25 22.14,33.25 22.28,33.4 | C22.1 23.53,34.64 22.28,33.4
  Top 0.508: C1.1 23.76,34.64 C22.1 23.07,35.36 23.07,36.05 25.57,38.56 R22.2 28.26,38.56 FB2.2
+5V  (via drill 0.5)
  Top 0.254: IC1.7 IC1.8 52.35,18.66 53.01,19.32 C10.1
  Top 0.406: FB1.2 53.03,10.19 53.87,10.19 J1.4 J1.2 59.45,13.23 59.45,15.57 55.7,19.32 C10.1
  Top 0.508: 43.84,7.25 45.72,5.38 C3.1 45.97,4.96 C12.1 48.23,6.3 51.1,9.18 FB1.2 | v44.58,8.07 43.03,8.07 | 43.03,8.07 MCP1825.1 | v45.42,7.25 43.84,7.25 | 43.84,7.25 43.03,8.07
  Bottom 0.406: 1.12,50.71 1.12,19.98
  Bottom 0.508: JP2.4 2.44,52.03 1.12,50.71 | v44.58,8.07 44.58,6.41 | 1.12,19.98 7.17,13.93 7.17,3.68 9.87,0.99 40.51,0.99 44.58,5.05 44.58,6.41 | 44.58,6.41 v45.42,7.25
+5V_EXT
  Top 0.406: FB1.1 54.83,7.91 U$10.VBUS
AC
  Top 0.508: U$1.PWR2 58.09,60.06 R20.1
ADC0
  Top 0.508: R20.2 R19.1 44.82,50.8 RFV.1
AGND  (via drill 0.5)
  Top 0.254: STM32.8 20.8,32.19 C1.2 21.77,31.73 v22.57,31.73 | v27.23,35.79 25.33,35.79 C22.2
  Top 0.305: v22.57,31.73 23.17,31.73 v27.23,35.79 | FB4.1 31.34,4.99 v31.14,5.19
  Bottom 0.305: v27.23,35.79 26.23,34.79 23.17,31.73 v22.57,31.73
  Bottom 0.406: v31.14,5.19 31.14,6.83 25.89,12.07 25.89,20.03 29.71,23.85 29.71,31.31 26.23,34.79
BIAS  (via drill 0.5)
  Top 0.254: STM32.16 21.09,38.86 v21.9,38.86 | R5.2 45.46,55.19 45.45,55.2 | CT1.P$4 41.35,58.01 | 28.63,57.95 CT2.P$4 | U$1.GNDBREAK 47.09,66.66 46.71,67.04 | U$1.GND 47.09,71.19 46.71,70.81
  Top 0.508: 45.46,55.19 43.03,52.76 v38.01,52.76 | R5.2 49.14,58.87 | 49.14,58.87 R19.2 | 49.14,58.87 49.14,63.77 U$1.GNDBREAK 45.57,67.34 42.25,67.34 | 45.45,55.2 RB1.2 41.35,58.01 | R6.2 RB2.2 28.63,57.95 | 46.71,67.04 46.71,70.81 | 42.25,67.34 36.2,67.34 | 36.2,67.34 29.24,67.34 | 29.24,67.34 23.54,67.34 | 23.54,67.34 16.58,67.34 | 16.58,67.34 12.54,67.34 | CT3.P$1 10.61,69.27 12.54,67.34 | CT1.P$1 36.15,67.38 36.2,67.34 | CT2.P$1 23.38,67.49 23.54,67.34 | 16.58,67.34 16.58,60.57 CT3.P$4 15.94,57.87 RB3.2 R7.2 | CT2.P$4 29.24,60.46 29.24,67.34 | CT1.P$4 42.25,60.7 42.25,67.34 | 12.54,67.34 10.32,67.34 7.82,64.84 7.82,50.87 10.77,47.93 10.77,46.17 v10.82,46.11
  Bottom 0.508: v38.01,52.76 31.06,45.81 24.44,45.81 22.79,44.16 22.79,43.4 | 22.79,43.4 22.72,43.33 20.41,45.64 11.3,45.64 v10.82,46.11 | 22.79,43.4 22.79,39.76 v21.9,38.86
BIAS_IN
  Top 0.254: 24.86,39.92 21.43,39.92 STM32.17
  Top 0.305: 26.5,40.99 R22.1 26.5,40.87 26.16,41.22 24.86,39.92 | 26.32,41.73 26.32,40.99 26.5,40.99 | 26.32,41.73 26.32,41.76 R23.2 | C18.1 25.89,41.3 26.32,41.73 | C5.1 28.39,40.99 26.5,40.99
BOOT0  (via drill 0.5)
  Top 0.203: BOOT0.1 8.12,27.97 v8.12,26.74 | v8.04,25.02 8.04,23.69 18.97,12.77 21.38,12.77 v21.75,13.14 | v23.7,14.06 25.32,15.68 25.32,19.14 25.22,19.24 v25.01,19.24 | v26.86,22.47 27.22,22.47 30,19.69 39.73,19.69 v39.91,19.5 | v45.44,17.16 45.53,17.24
  Top 0.254: STM32.44 11.82,30.31 R2.1 8.43,30.31 BOOT0.1 | J1.7 48.02,16.25 46.52,16.25 45.53,17.24 45.53,17.96 46.23,18.66 IC1.28
  Bottom 0.203: v8.12,26.74 8.12,25.1 v8.04,25.02 | v21.75,13.14 22.67,14.06 v23.7,14.06 | v25.01,19.24 25.22,19.44 25.22,20.24 26.86,21.88 v26.86,22.47 | v39.91,19.5 39.82,19.41 39.82,17.87 40.6,17.09 45.37,17.09 v45.44,17.16
CP2102_RX  (via drill 0.5)
  Top 0.254: IC1.25 44.87,20.16 | 44.87,20.16 42.51,20.16 JP1.1 | JP11.1 61.09,23.32 59.63,21.86 v58.99,21.86 | v44.87,20.85 44.87,20.16
  Bottom 0.254: v58.99,21.86 58.17,21.86 57.51,22.52 54.65,22.52 53.96,23.2 46.86,23.2 44.87,21.21 v44.87,20.85
CP2102_TX  (via drill 0.5)
  Top 0.254: JP12.1 59.01,23.84 v59.01,22.99 | JP1.2 43.22,19.66 IC1.26
  Bottom 0.254: v59.01,22.99 54.79,22.99 54.11,23.66 46.65,23.66 43.73,20.74 43.73,19.06 42.95,18.28 JP1.2
CT1
  Top 0.254: CF1.1 21.6,45.04 18.25,45.04 15.13,41.93 STM32.25
  Top 0.508: CF1.1 RF1.2
CT2
  Top 0.254: CF2.1 13.75,41.76 13.75,40.67 STM32.27
  Top 0.508: CF2.1 RF2.2
CT3
  Top 0.254: STM32.28 12.87,40.83 12.87,45.45 CF3.1
  Top 0.508: RF3.2 CF3.1
D+  (via drill 0.5)
  Top 0.254: U$10.D+ 56.43,9.89 v56.46,9.92 | IC1.4 49.55,16.66 50.33,15.88 v50.33,15.86
  Bottom 0.254: v56.46,9.92 56.46,10.99 56.51,11.04 56.51,15.27 56.07,15.71 50.64,15.71 50.5,15.85 50.42,15.96 v50.33,15.86
D-  (via drill 0.5)
  Top 0.254: v55.16,9.86 55.63,9.38 U$10.D- | IC1.5 50.05,17.22 51.43,15.83 51.43,13.26 51.86,12.83 v53.94,12.83
  Bottom 0.254: v53.94,12.83 53.97,12.8 53.97,11.04 54.72,10.29 v55.16,9.86
DS18B20  (via drill 0.5)
  Top 0.203: STM32.21 16.94,38.26 v16.94,38.12 | v8.58,40.86 6.02,38.3 v6.02,38.02 | v5.26,36.15 4.22,35.12 2.08,35.12 1.5,34.54 1.5,27.47 14,14.97 R1.1 13.23,10.56 DS18B20.2
  Bottom 0.203: v16.94,38.12 16.8,38.26 14.01,38.26 11.41,40.86 v8.58,40.86 | v6.02,38.02 5.26,37.25 v5.26,36.15
ESP_CLK
  Top 0.254: U1.30 54.42,24.94 JP7.1
ESP_CS
  Top 0.254: U1.29 53.15,25.26 JP10.1
ESP_MISO
  Top 0.254: U1.31 55.69,25.5 JP8.1
ESP_MOSI
  Top 0.254: U1.37 63.36,26.89 JP9.1
ESP_RX
  Top 0.229: U1.34 59.5,25.34 JP12.2
ESP_TX
  Top 0.229: U1.35 60.77,25.34 JP11.2
GND  (via drill 0.5)
  Top 0.254: C8.2 18.43,41.16 STM32.23 16.12,38.85 v16.12,35.62 | C6.2 10.55,38.21 STM32.35 12.27,36.49 14.53,36.49 15.26,35.75 15.99,35.75 v16.12,35.62 | C9.2 13.82,30.19 STM32.47 16.12,32.49 v16.12,35.62 | IC1.3 49.05,19.66 IC1.EXP | v47.35,17.06 47.44,17.15 IC1.M 46.89,18.06 v46.49,17.65 | v54.22,18.1 54.34,17.99 C11.2
  Top 0.813: U1.38 64.58,28.68 62.39,30.87 v59.3,30.87
  Bottom 0.254: v47.35,17.06 47.08,17.06 v46.49,17.65
  other vias: 11.79,49.08 16.62,49.3 21.26,49.25 25.72,49.27 20.11,42.39 12.74,28.58 13.04,27.47 8.65,39.73 4.05,32.21 18.21,27.23 27.86,29.8 21.13,70.05 33.84,69.93 48.97,68.93 45.01,60.91 32.26,61.47 19.27,61.55 31.94,48.8 40.52,6.14 41.86,5.92 39.11,5.86 57.61,2.24 56.14,2.2 54.46,1.98 62.04,4.38 51.46,4.31 49.52,20.16 15.32,36.36 53.15,18.09 53.87,22.23 56.37,20.74 57.08,19.76 59.33,32.22 44.9,23.46 43.85,22.58 43.62,48.11 41.11,47.95 40.75,45.7 53.66,51.26 56.3,51.14 51.43,49.68 67.74,47.99 66.74,49.51 65.11,47.91 61.69,48.21 61.75,50.84 61.78,53.96 61.67,56.7 64.41,57.62 66.55,56.02 67.93,57.54 70.16,57.65 69.23,52.58 40.72,68.99 55.26,37.94 55.19,36.73 55.28,35.43 53.63,35.72 53.61,37.06 53.67,38.38 24.32,18.17 24.32,16.95 30.83,23.33 30.66,33.6 35.52,33.02 38.22,43.56 36.72,33.81 36.81,32.47 7.33,37.85 9.56,44.22 6.38,40.51 8.72,47.61 28.13,26.82 44.28,2.33 47.64,1.98 30.21,43.91 27.89,44.63 25.24,44.58 56.42,38.15 56.89,39.93 55.6,39.82 54.23,39.83 41.84,29.79 42.83,30.55 30.92,16.42 30.58,17.5 33.62,9.93 26.98,15.4 27.01,13.35 24.87,9.43 18.03,10.88 15.48,13.8 11.14,13.88 4.51,21.23 9.33,27.21 8.96,33.4 6.84,32.35 6.19,35.32 9.81,39.71 14.35,44.2 20.11,43.96 21.87,41.02 18.6,35.73
  pour Top: 0.67,10.2 arc90 -1.54,6.95 0.98,6.95 arc-90 4.41,3.52 4.41,1 arc90 5.41,0 63.55,0 arc90 64.55,1 64.55,3.52 arc-90 67.98,6.95 70.5,6.95 arc90 71.5,7.95 71.5,66.09 arc90 70.5,67.09 67.98,67.09 arc-90 64.55,70.52 64.55,73.04 arc90 63.55,74.04 5.41,74.04 arc90 4.41,73.04 4.41,70.52 arc-90 0.98,67.09 -1.54,67.09 arc90 0.67,63.89
  pour Bottom: 0.74,10.25 arc90 -1.47,7 1.05,7 arc-90 4.48,3.57 4.48,1.05 arc90 5.48,0.05 63.62,0.05 arc90 64.62,1.05 64.62,3.57 arc-90 68.05,7 70.57,7 arc90 71.57,8 71.57,66.14 arc90 70.57,67.14 68.05,67.14 arc-90 64.62,70.57 64.62,73.09 arc90 63.62,74.09 5.48,74.09 arc90 4.48,73.09 4.48,70.57 arc-90 1.05,67.14 -1.47,67.14 arc90 0.74,63.95
HSE_IN
  Top 0.254: STM32.5 19.07,31.8 19.07,31.78 22.38,28.47 22.38,25.86 HSE.1 20.92,24.4 C14.1
HSE_OUT
  Top 0.254: STM32.6 19.02,32.54 21.32,30.24 23.37,30.24 HSE.3 25.3,32.17 C15.1
LED
  Top 0.254: R3.2 8.74,31.89 11.99,31.89 STM32.42
N$2
  Top 0.508: CT1.P$2 36.15,58.7 RB1.1 R5.1 32.38,52.27 25.73,52.27 RF1.1
N$8
  Top 0.508: CT2.P$2 23.38,58.75 RB2.1 R6.1 22.69,54.39 19.69,51.39 RF2.1
N$10
  Top 0.508: CT3.P$2 10.61,58.84 RB3.1 | R7.1 RB3.1 | RF3.1 15.12,52.53 14.24,53.41 RB3.1
N$18
  Bottom 1.016: U$2.8 59.56,50 arc-90 62.1,52.54 SMA.1
N$41
  Top 0.508: R3.1 2.62,33.83 LED1.A
NRST
  Top 0.254: C2.2 16.88,29.19 16.24,29.83 16.24,31.99 17.82,33.57 18.72,33.57 STM32.7
PULSE
  Top 0.254: STM32.43 12.12,31.32 4.22,31.32 3.22,30.32 3.22,27.94 19.1,12.06 21.45,12.06 C16.1 22.51,11 23.73,9.78 PULSE.2
RFM_IRQ  (via drill 0.5)
  Top 0.203: STM32.11 21.31,33.81 21.55,33.81 22.02,34.29 22.02,34.97 v22.14,35.08 | v26.28,37.18 29.76,37.18 v31.57,35.37 | v34.43,34.48 34.99,35.03 40.26,35.03 v41.11,35.88
  Bottom 0.203: v22.14,35.08 24.23,37.18 v26.28,37.18 | v31.57,35.37 33.54,35.37 v34.43,34.48 | v41.11,35.88 43.43,35.88 U$2.2
RFM_RST  (via drill 0.5)
  Top 0.203: v40.2,43.91 36.25,39.96 v28.66,39.96 | v24.85,39.08 22.42,36.65 22.42,36.47 21.15,35.19 STM32.12
  Bottom 0.203: U$2.6 43.45,43.91 v40.2,43.91 | v28.66,39.96 27.77,39.08 v24.85,39.08
RPI_CONNECTED  (via drill 0.5)
  Top 0.203: R8.2 38.29,18.07 | 38.29,18.07 39.41,18.07 R9.2 | 38.29,18.07 38.29,18.89 v38.37,18.97 | v45.09,30.43 45.66,31 U1.23 | STM32.2 18.31,30.45 18.31,28.57 17.42,27.68 17.42,24.7 18.01,24.1 18.01,23.13 19.75,21.39 v20.11,21.39 | v23.94,15.72 23.42,16.23 23.42,22.22 25.86,24.66 31.71,24.66 33.97,26.92 43.56,26.92 v43.91,26.58
  Bottom 0.203: v38.37,18.97 38.37,20.74 39.54,21.92 41.58,21.92 43.91,24.25 v43.91,26.58 43.91,27.23 42.94,28.2 42.83,28.2 42.83,29 44.26,30.43 v45.09,30.43 | v20.11,21.39 19.23,20.51 19.21,20.51 19.21,19.53 19.55,19.18 20.85,19.18 22.32,17.71 22.32,16.45 23.06,15.72 v23.94,15.72
RPI_CONNECTED_PR
  Top 0.254: J1.17 37.46,16.2 R8.1
RPI_CS  (via drill 0.5)
  Top 0.254: J1.24 JP6.1 | v31,20.88 34.9,24.78 50.41,24.78 51.39,23.8 JP10.2
  Bottom 0.254: J1.24 29.53,11.56 28.12,12.97 28.12,18 v31,20.88
RPI_MISO  (via drill 0.5)
  Top 0.254: J1.21 32.38,16 JP4.2 | v41.66,25.66 42.03,25.28 51.07,25.28 v51.35,25 | v57.39,23.87 57.34,23.82 JP8.2
  Bottom 0.254: J1.21 32.38,14.76 34.69,17.06 35.25,17.06 35.92,17.73 35.92,19.77 38.99,22.84 41.14,22.84 42.34,24.03 42.34,25.14 41.82,25.66 v41.66,25.66 | v51.35,25 52.13,24.22 54.61,24.22 54.96,23.87 v57.39,23.87
RPI_MOSI  (via drill 0.5)
  Top 0.254: J1.19 34.92,15.99 JP3.2 | JP9.2 63.12,23.49 v63.12,22.75 | v46.65,26.16 44.98,26.16 44.63,25.81 43.07,25.81 v42.73,26.15
  Bottom 0.254: J1.19 34.92,16.05 36.43,17.56 36.43,19.67 39.16,22.4 41.31,22.4 43.41,24.5 43.41,25.53 43.15,25.78 43.1,25.78 v42.73,26.15 | v63.12,22.75 62.04,22.75 58.22,26.57 47.06,26.57 v46.65,26.16
RST_STM  (via drill 0.5)
  Top 0.203: JP2.1 4.79,44.41 v6.35,42.84 | R4.1 19.52,20.08 v20.42,20.08 | v27.56,23.49 27.84,23.21 27.84,22.4 30.18,20.07 38.85,20.07 v39.17,20.39
  Top 0.254: IC1.24 46.21,20.66 v45.98,20.89 | v44.57,18.74 v44.57,16.38 44.57,14.62 J1.11 | R4.1 18.56,20.9 17.56,21.9 C2.1 16.88,21.14 v17.32,20.69 | JP2.1 2.85,44.41 1.47,43.03 1.47,38.63 STLINK.3
  Bottom 0.203: v20.42,20.08 24.49,20.08 25.52,21.12 25.52,22.12 26.88,23.49 v27.56,23.49 | v39.17,20.39 39.17,17.7 40.21,16.66 44.13,16.66 44.16,16.69 44.27,16.69 v44.57,16.38
  Bottom 0.254: v45.98,20.89 44.57,19.49 v44.57,18.74 | v17.32,20.69 12.75,20.69 10.19,23.26 10.19,36.35 7.73,38.81 7.73,41.47 v6.35,42.84
SCL  (via drill 0.5)
  Top 0.203: 31.71,27.77 v31.87,27.77
  Top 0.229: STM32.45 11.54,29.32 v11.25,29.32 | v12.4,22.45 13.33,21.52 13.33,20.26 16.82,16.77 v17.98,16.77 | v21.22,17.22 21.55,17.54 21.55,22.52 26.79,27.77 31.71,27.77 | v45.17,27.43 43.92,27.43 43.58,27.77 v34.25,27.77 | v51.48,29.37 51.71,29.59 60.44,29.59 62.16,27.87 62.16,26.82
  Top 0.254: v55.55,16.82 55.55,15.92 55.29,15.66 54.26,15.66 J1.5 | v58.99,19.94 62.16,23.11 62.16,26.82 U1.36
  Bottom 0.203: v31.87,27.77 v34.25,27.77
  Bottom 0.229: v11.25,29.32 10.84,28.91 10.84,27.63 11.91,26.56 11.91,22.93 v12.4,22.45 | v17.98,16.77 17.98,17.16 18.38,17.56 20.14,17.56 20.48,17.22 v21.22,17.22 | v45.17,27.43 45.49,27.75 45.49,28.54 46.66,29.7 50.34,29.7 50.68,29.37 v51.48,29.37
  Bottom 0.254: v58.99,19.94 58.93,20.2 v55.55,16.82
SDA  (via drill 0.5)
  Top 0.203: v31.64,28.91 31.61,28.91 30.87,28.17 | v34.41,28.94 35.12,28.23 35.12,28.26
  Top 0.229: STM32.46 11.97,29.04 11.97,29.02 11.62,28.67 v11.62,28.12 | v13.17,23.21 13.73,22.65 13.73,21.37 v17.03,17.75 | v20.14,18.3 21.14,19.3 21.14,22.77 26.54,28.17 30.87,28.17 | v44.09,28.51 43.92,28.51 43.67,28.26 35.12,28.26 | v50.57,30.45 50.57,28.87 50.87,28.57 54.31,28.57 54.84,29.09 57.59,29.09 58.23,28.45 U1.33
  Top 0.254: J1.3 57.22,16.08 v57.22,16.38 | v58.77,18.48 58.23,19.02 U1.33
  Bottom 0.203: v31.64,28.91 34.37,28.91 v34.41,28.94
  Bottom 0.229: v11.62,28.12 11.62,27.52 12.32,26.82 12.32,24.06 v13.17,23.21 | v17.03,17.75 17.33,17.96 19.8,17.96 v20.14,18.3 | v44.09,28.51 44.41,28.83 45.21,28.83 46.49,30.11 50.34,30.11 50.57,30.34 v50.57,30.45
  Bottom 0.254: v57.22,16.38 58.77,17.92 v58.77,18.48
SPI3_MISO  (via drill 0.5)
  Top 0.203: 28.5,19.25 28.21,19.54 28.09,19.54 25.54,22.09 25.19,22.44 v25.19,22.93 | STM32.40 12.81,34.13 14.44,34.13 v14.5,34.19 | v35.72,23.75 35.05,23.08 34.34,23.08 v32.24,20.97 | v32.29,18.05 32.29,17.14 JP4.1
  Top 0.254: JP4.1 30.87,18.55 29.2,18.55 28.5,19.25
  Bottom 0.203: v25.19,22.93 23.43,24.69 22.94,24.69 14.5,33.13 v14.5,34.19 | U$2.1 42.17,32.62 41.43,32.62 38.92,30.12 38.92,26.95 v35.72,23.75 | v32.24,20.97 32.24,18.1 v32.29,18.05
SPI3_MOSI  (via drill 0.5)
  Top 0.203: 29.06,19.81 28.94,19.92 28.25,19.92 26.16,22.01 v26.16,23.85 | STM32.41 13.13,33.74 13.83,33.74 14.23,33.34 v15.31,33.34 | v37.26,23.75 36.2,22.7 34.6,22.7 33.43,21.53 v33.43,21.16 | v34.93,18.03 JP3.1
  Top 0.254: JP3.1 32.87,19.1 29.77,19.1 29.06,19.81
  Bottom 0.203: v26.16,23.85 24.93,25.07 23.1,25.07 15.31,32.86 v15.31,33.34 | 56.83,36.87 56.21,36.25 56.21,34.96 55.47,34.22 53.18,34.22 51.2,32.24 41.59,32.24 39.3,29.96 39.3,25.8 v37.26,23.75 | v33.43,21.16 34.93,19.66 v34.93,18.03
  Bottom 0.254: U$2.12 57.98,38.02 56.83,36.87
SPI3_NSS  (via drill 0.5)
  Top 0.203: 27.56,18.08 v27.31,17.83 26.99,18.15 26.99,19.56 25.59,20.96 24.17,20.96 v24.15,20.94 | v12.56,35.29 v12.56,35.28 STM32.38 | v35.77,21.5 38.25,21.5 v40.34,23.59
  Top 0.254: JP6.2 28.99,8.5 28.14,9.35 28.14,17.5 27.56,18.08
  Bottom 0.203: v24.15,20.94 22.29,22.81 22.29,24.26 12.56,34 v12.56,35.29 | U$2.14 56.36,34.02 55.8,33.46 54.16,33.46 52.18,31.48 41.9,31.48 40.07,29.64 40.07,27.61 40.34,27.34 v40.34,23.59 | v35.77,21.5 34.81,22.47 30.14,22.47 26.99,19.31 26.99,18.15 v27.31,17.83
SPI_CLK  (via drill 0.5)
  Top 0.203: 27.95,18.72 v27.82,18.85 27.82,19.27 25.38,21.71 | STM32.39 12.53,34.55 13.19,34.55 v13.65,35.01 | v24.3,22.05 25.04,22.05 25.38,21.71 | 25.38,21.71 | v34.58,21.61 35.29,22.32 37.36,22.32 v38.79,23.75 39.34,24.3 42.28,24.3 42.31,24.27 50.26,24.27 51.44,23.09 53.75,23.09 JP7.2
  Top 0.254: 27.95,18.72 29.84,16.83 J1.23
  Bottom 0.203: v24.3,22.05 22.67,23.68 22.67,24.42 13.65,33.44 v13.65,35.01 | U$2.13 57.82,36.02 55.64,33.84 53.46,33.84 51.48,31.86 41.75,31.86 39.69,29.8 39.69,24.65 v38.79,23.75 | v34.58,21.61 34.14,22.04 31.01,22.04 v27.82,18.86 v27.82,18.85
STM_RX  (via drill 0.5)
  Top 0.254: STM32.31 4.64,46.95 JP2.2 | J1.8 50.16,9.58 v48.41,7.83 | v49.36,5.68 49.36,1.92 48.58,1.14 46.48,1.14 45.95,0.62 43.03,0.62 42.65,0.23 37.64,0.23 37.16,0.71 8.23,0.71 5.9,3.05 5.9,5.22 1.58,9.54 1.58,24.98 v2.18,25.58
  Bottom 0.203: JP2.2 1.6,45.16 1.6,43.93 1.61,43.91 1.61,43.11 1.63,43.09
  Bottom 0.254: v48.41,7.83 48.41,6.63 v49.36,5.68 | v2.18,25.58 2.29,25.69 2.29,28.02 2.32,28.04 1.92,28.44 1.92,35.63 1.63,35.91 1.63,43.09
STM_TX  (via drill 0.5)
  Top 0.203: v7.6,45.82 7.09,45.31 6.98,45.31
  Top 0.254: JP2.3 4.46,49.49 5.46,48.48 5.46,46.83 6.98,45.31 STM32.30 | J1.10 47.62,6.71 v47.23,6.32 | v47.13,4.1 47.13,2.75 45.5,1.12 42.93,1.12 42.47,0.66 37.82,0.66 37.34,1.14 8.41,1.14 6.33,3.23 6.33,5.51 2.01,9.83 2.01,24 2.75,24.75 v3.13,24.37
  Bottom 0.203: v7.6,45.82 7.6,45.76 5.03,43.19 2.34,43.19 2.08,42.93 2.08,42.87
  Bottom 0.254: v47.23,6.32 47.23,4.21 v47.13,4.1 | 2.08,42.87 2.08,36.07 2.35,35.81 2.35,28.62 2.97,27.99 2.97,27.75 3.13,27.6 v3.13,24.37
SWCLK
  Top 0.254: STM32.37 8.14,34.68 3.54,39.28 STLINK.2
SWDIO
  Top 0.254: STLINK.1 8.9,41.82 11.64,39.08 11.64,38.51 11.39,38.26 11.39,38.07 STM32.34
VSIG
  Top 0.254: STM32.20 21.09,41.7 21.09,43.38 23.11,45.41 26.53,45.41 CFV.1
  Top 0.508: RFV.2 CFV.1

### Text on the board
tPlace: GND | 5V | Tx | Rx | RST | DIO | CLK | RST | Designed in | emonSTM32mini | North Wales | Development Board | Made in UK | OpenEnergyMonitor | Tx | v0.2 | Rx | Open-Hardware
tValues: GND | T | 3V3 | GND | P | 3V3 | DS18B20 | PULSE INPUT